# EasyEDA schematic SCH_usbc_module_2022-02-18.json
TITLE: usbc->hdmi adapter; REV: 2.0; Date: 2021-12-03; Sheet: 1/1; Drawn By: Michael Ruiz; Company: GR
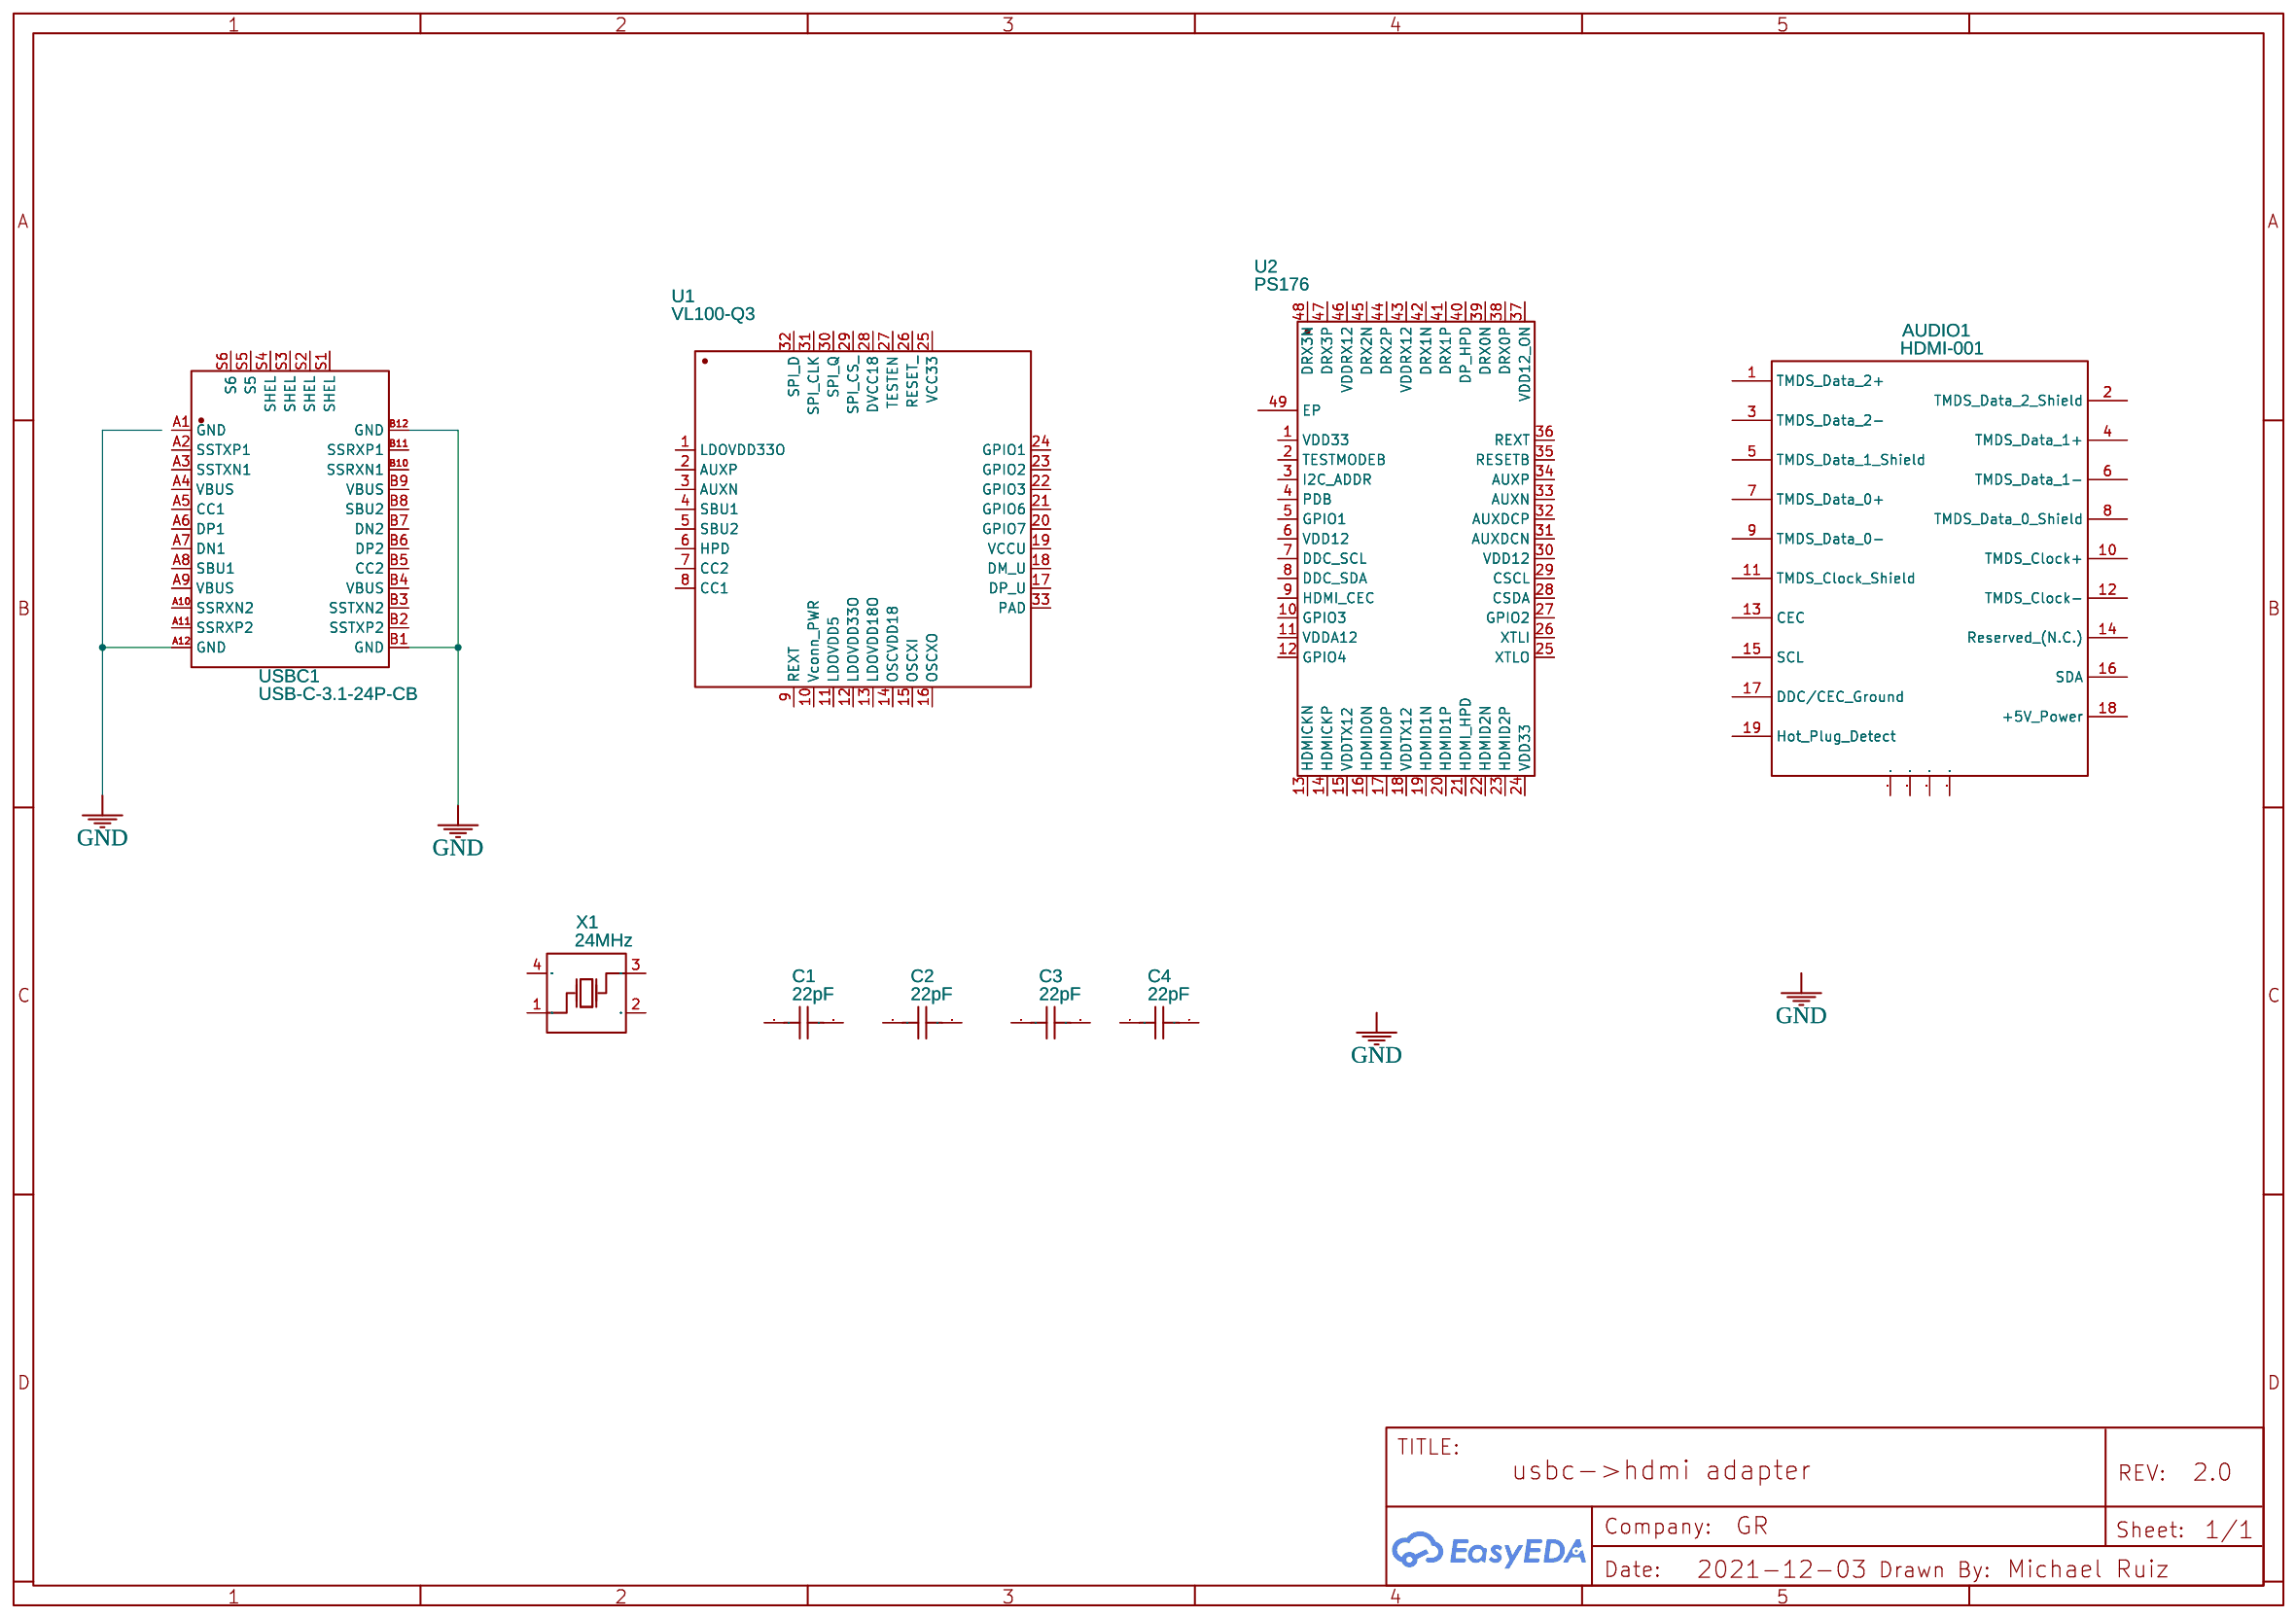
[diagram p0: schematic sheet]

## Parts
AUDIO1  HDMI-001  [HDMI-SMD_19P-P0.50-H-F]
C1  22pF  [C0603]
C2  22pF  [C0603]
C3  22pF  [C0603]
C4  22pF  [C0603]
U1  VL100-Q3  [QFN-32_L5.0-W5.0-P0.50-BL-EP3.4]
U2  PS176  [QFN-48_L6.0-W6.0-P0.40-TL-EP3.8]
USBC1  USB-C-3.1-24P-CB  [USB-C-SMD_C67379]
X1  24MHz  [CRYSTAL-SMD_4P-L2.5-W2.0-BL-B]

## Library data of the parts
AUDIO1 = HDMI-001: Supplier: LCSC; Supplier Part: C138388; Manufacturer: Boom Precision Elec; Contributor: LCSC; JLCPCB Part Class: Extended Part
C1-C4 = 0603N220J500CT_C2875465: Supplier: LCSC; Supplier Part: C2875465; Manufacturer: 华新科(Walsin); Manufacturer Part: 0603N220J500CT; link: https://atta.szlcsc.com//upload/public/pdf/source/20210824/40E0661A8A04DEDB62EE09277884CD18.pdf; Contributor: LCSC
U1 = VL100-Q3: Supplier: LCSC; Manufacturer: VIA; Supplier Part: C69731; JLCPCB Part Class: Extended Part
U2 = PS176: Supplier: LCSC; Supplier Part: C209703; Manufacturer: Parade Technologies; Contributor: LCSC; JLCPCB Part Class: Extended Part
USBC1 = USB-C-3.1-24P-CB: Supplier: LCSC; Supplier Part: C67379; Manufacturer: LCSC; Contributor: LCSC; JLCPCB Part Class: Extended Part
X1 = S2224000091060: Supplier: LCSC; Supplier Part: C479185; Manufacturer: JGHC; Contributor: LCSC; JLCPCB Part Class: Extended Part

## Nets
GND: USBC1.A12(GND) USBC1.B1(GND) USBC1.B12(GND)

Not connected (* = marked no-connect by the designer): AUDIO1 1(TMDS Data 2+) 2(TMDS Data 2 Shield) 3(TMDS Data 2-) 4(TMDS Data 1+) 5(TMDS Data 1 Shield) 6(TMDS Data 1-) 7(TMDS Data 0+) 8(TMDS Data 0 Shield) 9(TMDS Data 0-) 10(TMDS Clock+) 11(TMDS Clock Shield) 12(TMDS Clock-) 13(CEC) 14(Reserved (N.C.)) 15(SCL) 16(SDA) 17(DDC/CEC Ground) 18(+5V Power) 19(Hot Plug Detect) 20 21 22 23; C1 1 2; C2 1 2; C3 1 2; C4 1 2; U1 1(LDOVDD33O) 2(AUXP) 3(AUXN) 4(SBU1) 5(SBU2) 6(HPD) 7(CC2) 8(CC1) 9(REXT) 10(Vconn_PWR) 11(LDOVDD5) 12(LDOVDD33O) 13(LDOVDD18O) 14(OSCVDD18) 15(OSCXI) 16(OSCXO) 17(DP_U) 18(DM_U) 19(VCCU) 20(GPIO7) 21(GPIO6) 22(GPIO3) 23(GPIO2) 24(GPIO1) 25(VCC33) 26(RESET_) 27(TESTEN) 28(DVCC18) 29(SPI_CS_) 30(SPI_Q) 31(SPI_CLK) 32(SPI_D) 33(PAD); U2 1(VDD33) 2(TESTMODEB) 3(I2C_ADDR) 4(PDB) 5(GPIO1) 6(VDD12) 7(DDC_SCL) 8(DDC_SDA) 9(HDMI_CEC) 10(GPIO3) 11(VDDA12) 12(GPIO4) 13(HDMICKN) 14(HDMICKP) 15(VDDTX12) 16(HDMID0N) 17(HDMID0P) 18(VDDTX12) 19(HDMID1N) 20(HDMID1P) 21(HDMI_HPD) 22(HDMID2N) 23(HDMID2P) 24(VDD33) 25(XTLO) 26(XTLI) 27(GPIO2) 28(CSDA) 29(CSCL) 30(VDD12) 31(AUXDCN) 32(AUXDCP) 33(AUXN) 34(AUXP) 35(RESETB) 36(REXT) 37(VDD12_ON) 38(DRX0P) 39(DRX0N) 40(DP_HPD) 41(DRX1P) 42(DRX1N) 43(VDDRX12) 44(DRX2P) 45(DRX2N) 46(VDDRX12) 47(DRX3P) 48(DRX3N) 49(EP); USBC1 A1(GND) A2(SSTXP1) A3(SSTXN1) A4(VBUS) A5(CC1) A6(DP1) A7(DN1) A8(SBU1) A9(VBUS) A10(SSRXN2) A11(SSRXP2) B2(SSTXP2) B3(SSTXN2) B4(VBUS) B5(CC2) B6(DP2) B7(DN2) B8(SBU2) B9(VBUS) B10(SSRXN1) B11(SSRXP1) S1(SHEL) S2(SHEL) S3(SHEL) S4(SHEL) S5 S6; X1 1(OSC1) 2(GND) 3(OSC2) 4(GND)
